# EAGLE board bmsbq (EAGLE 4.13), part 1 of 2
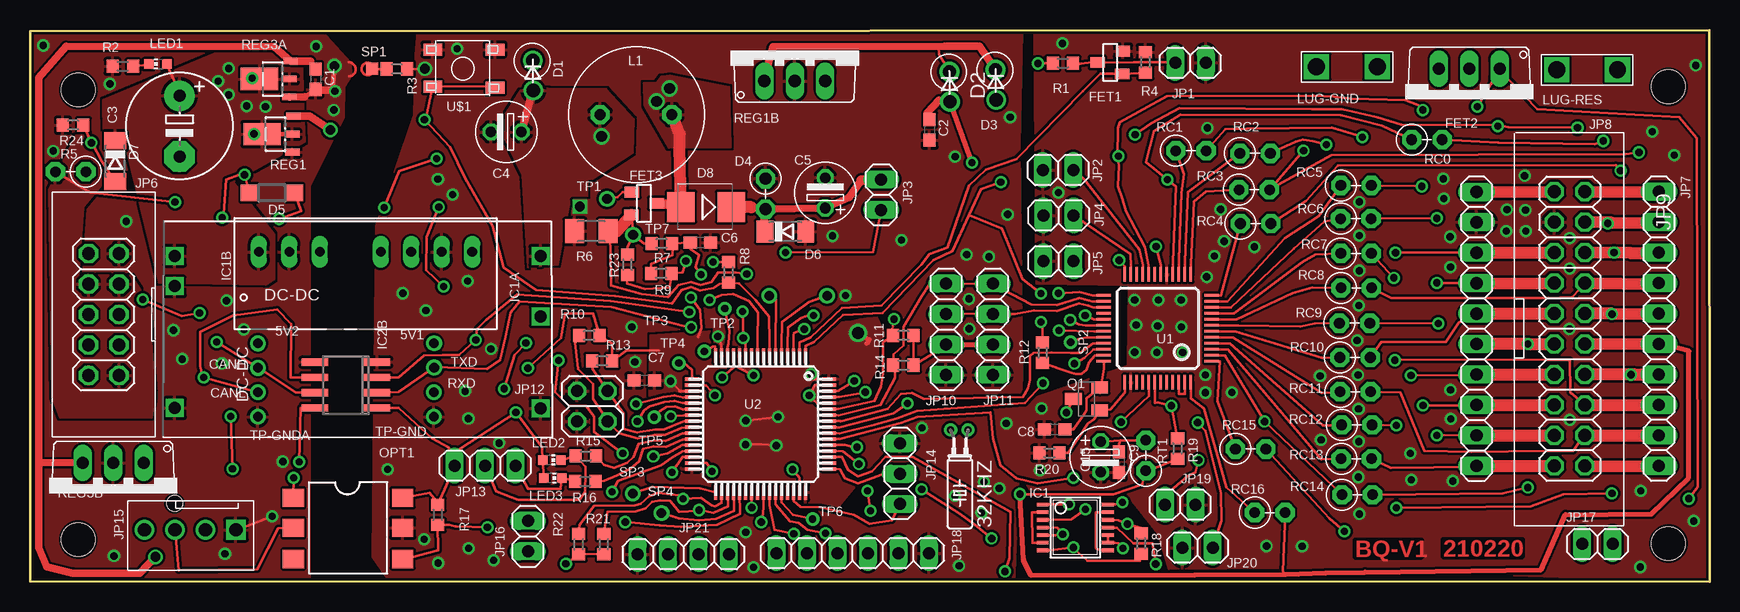
[diagram p2: board, top side]
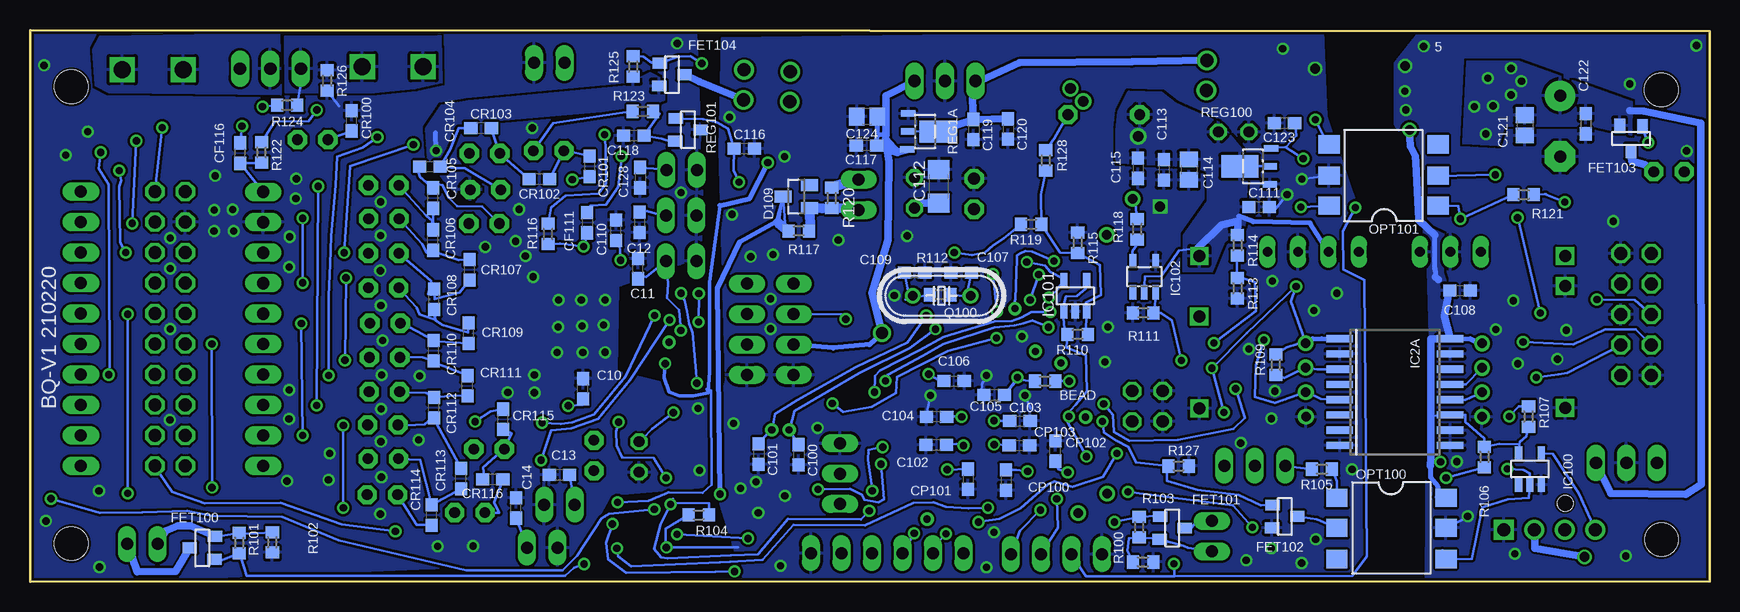
[diagram p3: board, bottom side, seen from below]

Size 140.02 x 46 mm. Coordinates in mm from the lower left corner, seen from the top.
Outline: 0.02,0.01 0,45.89 139.99,46 140.02,0 0.02,0.01
Copper layers (1*16): Top 0.035mm / dielectric 1.5mm / Bottom 0.035mm
Design rules "default": minimum track width 8mil, minimum drill 0.6mm, track to track 8mil, track to pad 8mil, pad to pad 8mil, via to via 8mil, smd to smd 0mil, copper to edge 8mil, drill to drill 8mil, minimum pad ring 10mil, minimum via ring 8mil, stop-mask expansion 4mil, vias tented up to drill 0mil, thermal gap 10mil
Holes 2.8 mm at 136.57,41.26 4.03,41 4.02,3.5 136.57,3.16

## Footprints (pad centres in the part's own frame; a part is rotated, then mirrored left to right if it is on the bottom)
SOLPAD028 = drill 0.8 pad 1.1 round: MP 0,0
32KHZ = drill 0.6 round: 1 -0.67,-3.1; 2 0.77,-3.1
R0603 = smd 1 x 1.1: 1 -0.85,0; 2 0.85,0
C0603 = smd 1.1 x 1: 1 -0.85,0; 2 0.85,0
E5-8,5 = drill 1.016 pad 2.54 round: + -2.54,0 | drill 1.016 pad 2.54 octagon: - 2.54,0
ES-2,5L = drill 0.889 pad 1.27 octagon: 1 0,0; 2 2.54,0
C1206 = smd 1.6 x 1.8: 1 -1.4,0; 2 1.4,0
C0805 = smd 1.3 x 1.5: 1 -0.85,0; 2 0.85,0
DO41-10_VERT = drill 1.1 round: A 2.58,0.05; C 0.07,0
ZENER-VERT = drill 1 pad 1.6 octagon: 1 0,0; 2 2.54,0
SOD123 = smd 1.4 x 1.4: A 1.9,0; C -1.9,0
SOD80C = smd 1.4 x 1.8: A 1.7,0; C -1.7,0
SMB_1 = smd 2.3 x 2.5: A 1.9,0; C -2.3,0
SOT23 = smd 1 x 1.4: 1 -0.95,-1.1; 2 0.95,-1.1; 3 0,1.1
SOT-23 = smd 0.9 x 1.2: 1 -1,-1.006; 2 0.9,-1.056; 3 -0.05,1.056
TO220V = drill 1.016 long: 1 -2.54,-2.54; 2 0,-2.54; 3 2.54,-2.54
TSSOP14 = smd 0.305 x 0.991: 1 -1.905,-2.718; 2 -1.27,-2.718; 3 -0.635,-2.718; 4 0,-2.718; 5 0.635,-2.718; 6 1.27,-2.718; 7 1.905,-2.718; 8 1.905,2.718; 9 1.27,2.718; 10 0.635,2.718; 11 0,2.718; 12 -0.635,2.718; 13 -1.27,2.718; 14 -1.905,2.718
PYBJ6-OD = drill 1 square: 1 -15.25,6.35; 2 -15.25,3.83; 3 -15.25,-6.33; 4 15.24,-6.36; 5 15.25,1.29; 6 15.24,6.35
DCDC7PINB = drill 0.813 long: 1 -7.62,2.51; 2 -5.08,2.51; 3 -2.54,2.51; 5 2.54,2.51; 6 5.08,2.51; 7 7.62,2.51; 8 10.16,2.51
SO-16DW = smd 0.6 x 2.2: 1 -4.445,-4.6; 2 -3.175,-4.6; 3 -1.905,-4.6; 4 -0.635,-4.6; 5 0.635,-4.6; 6 1.905,-4.6; 7 3.175,-4.6; 8 4.445,-4.6; 9 4.445,4.6; 10 3.175,4.6; 11 1.905,4.6; 12 0.635,4.6; 13 -0.635,4.6; 14 -1.905,4.6; 15 -3.175,4.6; 16 -4.445,4.6
SO-08 = smd 0.6 x 2.2: 1 -1.905,-2.6; 2 -0.635,-2.6; 3 0.635,-2.6; 4 1.905,-2.6; 5 1.905,2.6; 6 0.635,2.6; 7 -0.635,2.6; 8 -1.905,2.6
SOT-23' = smd 0.6 x 1.2: 1 -0.95,-1.306; 2 0,-1.306; 3 0.95,-1.306; 4 0.95,1.306; 5 -0.95,1.306
SOT23-5 = smd 0.6 x 1.2: 1 -0.95,-1.306; 2 0,-1.306; 3 0.95,-1.306; 4 0.95,1.306; 5 -0.95,1.306
SOT23-5' = smd 0.55 x 1.2: 1 -0.95,-1.3; 2 0,-1.3; 3 0.95,-1.3; 4 0.95,1.3; 5 -0.95,1.3
1X02 = drill 1 long: 1 -1.27,0; 2 1.27,0
2X05_KEYED = drill 1.067 octagon: 1 -5.08,-1.27; 2 -5.08,1.27; 3 -2.54,-1.27; 4 -2.54,1.27; 5 0,-1.27; 6 0,1.27; 7 2.54,-1.27; 8 2.54,1.27; 9 5.08,-1.27; 10 5.08,1.27
1X10 = drill 1.016 long: 1 -11.43,0; 2 -8.89,0; 3 -6.35,0; 4 -3.81,0; 5 -1.27,0; 6 1.27,0; 7 3.81,0; 8 6.35,0; 9 8.89,0; 10 11.43,0
2X10_KEYED = drill 1.067 octagon: 1 -11.46,-1.27; 2 -11.46,1.27; 3 -8.92,-1.27; 4 -8.92,1.27; 5 -6.38,-1.27; 6 -6.38,1.27; 7 -3.84,-1.27; 8 -3.84,1.27; 9 -1.3,-1.27; 10 -1.3,1.27; 11 1.24,-1.27; 12 1.24,1.27; 13 3.78,-1.27; 14 3.78,1.27; 15 6.32,-1.27; 16 6.32,1.27; 17 8.86,-1.27; 18 8.86,1.27; 19 11.4,-1.27; 20 11.4,1.27
1X04 = drill 1 long: 1 -3.81,0; 2 -1.27,0; 3 1.27,0; 4 3.81,0
2X02 = drill 1.016 octagon: 1 -1.27,-1.27; 2 -1.27,1.27; 3 1.27,-1.27; 4 1.27,1.27
1X03 = drill 1 long: 1 -2.54,0; 2 0,0; 3 2.54,0
1X4-MOLEXKK = drill 1.1 square: 1 3.81,0 | drill 1.1 round: 2 1.27,0; 3 -1.27,0; 4 -3.81,0 | hole 1.3: -1.3,2.2
1X06 = drill 1 long: 1 -6.35,0; 2 -3.81,0; 3 -1.27,0; 4 1.27,0; 5 3.81,0; 6 6.35,0
INDUCTOR6.0 = drill 0.9 pad 1.6 octagon: 1 -3.04,0; 2 2.94,0
CHIP-LED0603 = smd 0.8 x 0.8: A 0,-0.75; C 0,0.75
SPADE_TAB = drill 1.4 square: G1 -2.54,0; G2 2.54,0
SMD-6 = smd 1.52 x 1.78: P$1 -2.5,-4.5; P$2 0,-4.5; P$3 2.6,-4.5; P$4 2.6,4.6; P$5 0,4.6; P$6 -2.5,4.6
SOT23-BEC = smd 1 x 1.4: B -0.95,-1.1; C 0,1.1; E 0.95,-1.1
HC49/S = drill 0.8 round: 1 -2.413,0; 2 2.413,0
RS-2,5 = drill 0.889 pad 1.6 octagon: 1 0,0; 2 2.54,0
M1206 = smd 1.6 x 2: 1 -1.4,0; 2 1.4,0
SOT89 = smd 0.55 x 1.2: 1 -1.5,-1.4; 2 0,-1.4; 3 1.5,-1.5 | smd 1.85 x 3.1: 4 0,1.1
TO220V' = drill 1.016 long: 1 -3.81,-1.27; 2 -1.27,-1.27; 3 1.27,-1.27
SMD03 = smd 1 x 1: 1 0,0
SOLPAD.6MM = drill 0.6 pad 1.1 round: MP 0,0
TQFP48 = smd 0.208 x 1.2: 1 -2.75,-4.5; 2 -2.25,-4.5; 3 -1.75,-4.5; 4 -1.25,-4.5; 5 -0.75,-4.5; 6 -0.25,-4.5; 7 0.25,-4.5; 8 0.75,-4.5; 9 1.25,-4.5; 10 1.75,-4.5; 11 2.25,-4.5; 12 2.75,-4.5; 25 2.75,4.5; 26 2.25,4.5; 27 1.75,4.5; 28 1.25,4.5; 29 0.75,4.5; 30 0.25,4.5; 31 -0.25,4.5; 32 -0.75,4.5; 33 -1.25,4.5; 34 -1.75,4.5; 35 -2.25,4.5; 36 -2.75,4.5 | smd 1.2 x 0.208: 13 4.5,-2.75; 14 4.5,-2.25; 15 4.5,-1.75; 16 4.5,-1.25; 17 4.5,-0.75; 18 4.5,-0.25; 19 4.5,0.25; 20 4.5,0.75; 21 4.5,1.25; 22 4.5,1.75; 23 4.5,2.25; 24 4.5,2.75; 37 -4.5,2.75; 38 -4.5,2.25; 39 -4.5,1.75; 40 -4.5,1.25; 41 -4.5,0.75; 42 -4.5,0.25; 43 -4.5,-0.25; 44 -4.5,-0.75; 45 -4.5,-1.25; 46 -4.5,-1.75; 47 -4.5,-2.25; 48 -4.5,-2.75
TQFP64 = smd 1.2 x 0.26: 1 -5.7,3.75; 2 -5.7,3.25; 3 -5.7,2.75; 4 -5.7,2.25; 5 -5.7,1.75; 6 -5.7,1.25; 7 -5.7,0.75; 8 -5.7,0.25; 9 -5.7,-0.25; 10 -5.7,-0.75; 11 -5.7,-1.25; 12 -5.7,-1.75; 13 -5.7,-2.25; 14 -5.7,-2.75; 15 -5.7,-3.25; 16 -5.7,-3.75; 33 5.7,-3.75; 34 5.7,-3.25; 35 5.7,-2.75; 36 5.7,-2.25; 37 5.7,-1.75; 38 5.7,-1.25; 39 5.7,-0.75; 40 5.7,-0.25; 41 5.7,0.25; 42 5.7,0.75; 43 5.7,1.25; 44 5.7,1.75; 45 5.7,2.25; 46 5.7,2.75; 47 5.7,3.25; 48 5.7,3.75 | smd 0.26 x 1.2: 17 -3.75,-5.7; 18 -3.25,-5.7; 19 -2.75,-5.7; 20 -2.25,-5.7; 21 -1.75,-5.7; 22 -1.25,-5.7; 23 -0.75,-5.7; 24 -0.25,-5.7; 25 0.25,-5.7; 26 0.75,-5.7; 27 1.25,-5.7; 28 1.75,-5.7; 29 2.25,-5.7; 30 2.75,-5.7; 31 3.25,-5.7; 32 3.75,-5.7; 49 3.75,5.7; 50 3.25,5.7; 51 2.75,5.7; 52 2.25,5.7; 53 1.75,5.7; 54 1.25,5.7; 55 0.75,5.7; 56 0.25,5.7; 57 -0.25,5.7; 58 -0.75,5.7; 59 -1.25,5.7; 60 -1.75,5.7; 61 -2.25,5.7; 62 -2.75,5.7; 63 -3.25,5.7; 64 -3.75,5.7
E-SWITCH2 = smd 1.55 x 1: 1 -2.7,1.6; 2 2.5,1.5; 3 2.5,-1.6; 4 -2.7,-1.6

## Placement (x,y rotation side)
5V1  SOLDPAD028  [SOLPAD028]  33.68,19.88 0 top
5V2  SOLDPAD028  [SOLPAD028]  18.99,19.86 0 top
32KHZ  X100  [32KHZ]  77.51,9.55 180 top
BEAD  1  [R0603]  55.41,16.71 180 bottom
C1  1u  [C0603]  23.81,41.89 270 top
C2  1u  [C0603]  74.98,37.67 270 top
C3  0.1u  [E5-8,5]  12.47,37.98 270 top
C4  10@25V  [ES-2,5L]  40.96,37.5 180 top
C5  1u@100v  [ES-2,5L]  66.29,31.14 90 top
C6  0.1u  [C0603]  55.89,28.29 0 top
C7  100n  [C0603]  51.2,16.77 180 top
C8  22n  [C0603]  85.42,12.68 180 top
C9  1u  [C0603]  90.76,9.96 270 top
C10  1u  [C0603]  93.93,16.07 90 bottom
C11  10n  [C0603]  89.33,26.1 90 bottom
C12  10n  [C0603]  89.21,29.96 270 bottom
C13  10n  [C0603]  95.88,8.88 180 bottom
C14  10n  [C0603]  99.5,6.14 90 bottom
C15  1u@100v  [ES-2,5L]  89.25,11.66 270 top
C100  10p  [C0603]  75.94,10.57 270 bottom
C101  10p  [C0603]  79.28,10.63 270 bottom
C102  100n  [C0603]  64.48,11.39 180 bottom
C103  100n  [C0603]  57.5,13.39 0 bottom
C104  1u  [C0603]  64.45,13.74 180 bottom
C105  100n  [C0603]  59.65,15.55 180 bottom
C106  100n  [C0603]  62.99,16.72 0 bottom
C107  15p  [C0603]  62.4,25.77 180 bottom
C108  4.7u  [C0603]  20.82,24.26 0 bottom
C109  15p  [C0603]  66.28,25.79 0 bottom
C110  2.2u  [C0603]  91.15,29.29 90 bottom
C111  4.7u  [C0603]  37.57,31.25 0 bottom
C112  1u@100v  [C1206]  64.26,32.96 90 bottom
C113  10n  [C0603]  45.5,34.33 270 bottom
C114  4.7u  [C0805]  43.42,34.35 270 bottom
C115  0.1u  [C0603]  47.67,34.47 270 bottom
C116  2.2u  [C0603]  80.48,36.12 0 bottom
C117  100n  [C0603]  70.29,36.36 180 bottom
C118  2.2u  [C0603]  89.68,37.17 180 bottom
C119  4.7u  [C0603]  61.36,37.7 270 bottom
C120  100n  [C0603]  58.48,37.74 270 bottom
C121  4.7u  [C0805]  15.42,38.05 270 bottom
C122  4.7u  [C0603]  10.34,38.18 270 bottom
C123  4.7u  [C0603]  35.45,38.21 180 bottom
C124  4.7u  [C0805]  70.24,38.76 180 bottom
C128  10n  [C0603]  89.16,33.69 270 bottom
CANH  SOLDPAD028  [SOLPAD028]  18.99,17.82 0 top
CANL  SOLDPAD028  [SOLPAD028]  18.99,15.78 0 top
CF111  0.1u  [C0603]  93.57,29.93 270 bottom
CF116  0.1u  [C0603]  122.49,35.73 90 bottom
CP100  2.2u  [C0603]  58.67,8.46 270 bottom
CP101  2.2u  [C0603]  61.85,8.53 270 bottom
CP102  4.7u  [C0603]  54.56,10.89 90 bottom
CP103  4.7u  [C0603]  57.54,11.34 0 bottom
CR100  0.1u  [C0603]  113.2,38.43 90 bottom
CR101  0.1u  [C0603]  93.39,34.62 270 bottom
CR102  0.1u  [C0603]  97.57,33.58 0 bottom
CR103  0.1u  [C0603]  102.42,37.83 0 bottom
CR104  0.1u  [C0603]  106.68,34.6 0 bottom
CR105  0.1u  [C0603]  106.42,31.98 90 bottom
CR106  0.1u  [C0603]  106.43,28.48 90 bottom
CR107  0.1u  [C0603]  103.37,26 90 bottom
CR108  0.1u  [C0603]  106.32,23.54 90 bottom
CR109  0.1u  [C0603]  103.44,20.71 90 bottom
CR110  0.1u  [C0603]  106.37,19.25 90 bottom
CR111  0.1u  [C0603]  103.55,16.32 90 bottom
CR112  0.1u  [C0603]  106.35,14.5 90 bottom
CR113  0.1u  [C0603]  104.1,8.59 90 bottom
CR114  0.1u  [C0603]  106.54,5.55 90 bottom
CR115  0.1u  [C0603]  100.57,13.53 90 bottom
CR116  0.1u  [C0603]  101.45,8.51 180 bottom
D1  1N4148  [DO41-10_VERT]  41.91,43.53 270 top
D2  1N4148  [DO41-10_VERT]  76.64,42.59 270 top
D3  1N4148  [DO41-10_VERT]  80.49,42.75 270 top
D4  1N5357  [ZENER-VERT]  61.32,33.59 270 top
D5  1N4448  [SOD123]  20.17,32.42 180 top
D6  MMSZ52  [SOD80C]  62.96,29.19 0 top
D7  MMSZ52  [SOD80C]  7.1,35.06 270 top
D8  B100LB  [SMB_1]  56.16,31.24 180 top
D109  PMEG10020  [SOT23]  76.15,32.1 90 bottom
FET1  NFET  [SOT-23]  90.05,43.34 90 top
FET2  100v NFET  [TO220V]  119.98,40.23 180 top
FET3  PMV280ENEA  [SOT-23]  51.18,31.49 270 top
FET100  si2324A  [SOT-23]  125.65,2.86 90 bottom
FET101  NFET  [SOT-23]  44.81,4.41 270 bottom
FET102  NFET  [SOT-23]  35.43,5.38 270 bottom
FET103  PMV35EPE  [SOT-23]  6.61,36.95 180 bottom
FET104  PFET  [SOT-23]  86.51,42.23 270 bottom
IC1  7400  [TSSOP14]  87.13,4.51 270 top
IC1A  PYBJ6-OD  [PYBJ6-OD]  27.31,20.8 0 top
IC1B  AM6G1215SNZ  [DCDC7PINB]  26.7,24.98 0 top
IC2A  ISO1042-16PIN  [SO-16DW]  26.24,15.8 270 bottom
IC2B  ISO1042 8 PIN  [SO-08]  26.34,16.39 90 top
IC100  74LVC1G14  [SOT-23']  14.99,9.38 0 bottom
IC101  TLV521  [SOT23-5]  52.89,23.83 0 bottom
IC102  MCP1401|1416  [SOT23-5']  47.13,25.43 0 bottom
JP1  PB  [1X02]  96.74,43.26 180 top
JP2  THERM1  [1X02]  85.69,34.33 0 top
JP3  [1X02]  70.95,32.26 90 top
JP4  THERM2  [1X02]  85.73,30.53 0 top
JP5  THERM3  [1X02]  85.73,26.71 0 top
JP6  PINHD-2X5_KEYED  [2X05_KEYED]  6.15,22.27 90 top
JP7  OUTSIDE  [1X10]  135.78,21.08 270 top
JP8  INSIDE  [1X10]  120.58,21.07 270 top
JP9  PINHD-2X10_KEYED  [2X10_KEYED]  128.34,21.05 270 top
JP10  [1X04]  76.37,21.04 90 top
JP11  [1X04]  80.25,21.04 90 top
JP12  [2X02]  46.87,14.62 270 top
JP13  [1X03]  37.93,9.66 0 top
JP14  SWD  [1X03]  72.5,9 270 top
JP15  PINHD-1X4-MOLEXKK  [1X4-MOLEXKK]  13.35,4.32 0 top
JP16  Dump2  [1X02]  41.5,3.79 90 top
JP17  DUMP  [1X02]  130.65,3.13 0 top
JP18  FTDI  [1X06]  68.57,2.37 180 top
JP19  THERM4  [1X02]  95.88,6.41 180 top
JP20  THERM5  [1X02]  97.32,2.83 0 top
JP21  [1X04]  54.46,2.28 0 top
L1  RFB1010  [INDUCTOR6.0]  50.56,38.94 0 top
LED1  [CHIP-LED0603]  10.66,43.16 90 top
LED2  [CHIP-LED0603]  43.49,10.14 270 top
LED3  [CHIP-LED0603]  43.57,8.62 270 top
LUG-GND  MINUS  [SPADE_TAB]  109.78,42.93 0 top
LUG-RES  RESIS  [SPADE_TAB]  129.8,42.68 0 top
OPT1  H11L1S  [SMD-6]  26.46,4.47 270 top
OPT100  H11L1S  [SMD-6]  26.58,4.47 270 bottom
OPT101  H11L1S  [SMD-6]  27.14,33.86 90 bottom
Q1  BCX56-16TF  [SOT23-BEC]  88.07,15.24 90 top
Q100  [HC49/S]  64.03,23.84 180 bottom
R1  100K  [R0603]  86.1,43.22 0 top
R2  6.8K  [R0603]  7.74,42.97 0 top
R3  10M  [R0603]  30.58,42.75 0 top
R4  2M  [R0603]  92.98,43.3 270 top
R5  0.1  [RS-2,5]  4.66,34.18 180 top
R6  0.1  [M1206]  46.79,29.22 0 top
R7  1.5K  [R0603]  52.66,28.2 0 top
R8  10K  [R0603]  58.23,25.78 90 top
R9  zero?  [R0603]  52.61,25.7 0 top
R10  10K  [R0603]  46.61,20.53 0 top
R11  3.3K  [R0603]  72.8,20.53 180 top
R12  zero  [R0603]  84.4,19.08 270 top
R13  10K  [R0603]  47.69,18.4 0 top
R14  3.3K  [R0603]  72.8,18.04 180 top
R15  3.3K  [R0603]  46.33,10.47 0 top
R16  3.3K  [R0603]  46.29,8.35 0 top
R17  10K  [R0603]  33.99,5.56 90 top
R18  470K  [R0603]  92.62,3.18 270 top
R19  10K  [R0603]  95.66,11.1 270 top
R20  10M  [R0603]  84.98,10.72 180 top
R21  3.3K  [R0603]  47.83,3.11 270 top
R22  3.3K  [R0603]  45.73,3.11 270 top
R23  zero?  [R0603]  49.8,26.43 270 top
R24  1M  [R0603]  3.59,38.07 180 top
R100  10K  [R0603]  47.24,1.63 0 bottom
R101  470K  [R0603]  122.58,3.22 270 bottom
R102  1  [R0603]  119.82,3.27 90 bottom
R103  2M  [R0603]  47.56,4.54 270 bottom
R104  470K  [R0603]  84.27,5.56 180 bottom
R105  1.8K  [R0603]  32.33,9.37 180 bottom
R106  1.8K  [R0603]  18.78,10.39 270 bottom
R107  10K  [R0603]  15.11,13.76 270 bottom
R109  100K  [R0603]  36.17,18.07 90 bottom
R110  zero?  [R0603]  52.69,20.61 180 bottom
R111  470K  [R0603]  47.23,22.4 0 bottom
R112  1M  [R0603]  64.13,23.92 0 bottom
R113  6.8K  [R0603]  39.37,24.46 270 bottom
R114  33K  [R0603]  39.37,28.04 270 bottom
R115  210K  [R0603]  52.69,28.26 270 bottom
R116  100  [R0603]  96.84,28.99 270 bottom
R117  zero?  [R0603]  75.94,29.24 0 bottom
R118  6.8  [R0603]  47.73,29.39 270 bottom
R119  4M  [R0603]  56.56,29.79 180 bottom
R120  1  [R0603]  73.19,31.99 270 bottom
R121  3.3K  [R0603]  15.51,32.26 180 bottom
R122  100  [R0603]  120.71,35.79 90 bottom
R123  100K  [R0603]  88.93,39.21 180 bottom
R124  470K  [R0603]  118.58,39.73 180 bottom
R125  1M  [R0603]  89.74,42.95 270 bottom
R126  1K  [R0603]  115.25,41.78 270 bottom
R127  1M  [R0603]  44.27,9.63 0 bottom
R128  64K  [R0603]  55.35,35.13 90 bottom
RC0  [RS-2,5]  115.18,36.85 0 top
RC1  [RS-2,5]  95.51,35.93 0 top
RC2  [RS-2,5]  100.86,35.71 0 top
RC3  [RS-2,5]  100.78,32.68 0 top
RC4  [RS-2,5]  100.9,29.86 0 top
RC5  [RS-2,5]  109.27,33.04 0 top
RC6  [RS-2,5]  109.25,30.26 0 top
RC7  [RS-2,5]  109.27,27.37 0 top
RC8  [RS-2,5]  109.28,24.49 0 top
RC9  [RS-2,5]  109.15,21.55 0 top
RC10  [RS-2,5]  109.19,18.69 0 top
RC11  [RS-2,5]  109.21,15.83 0 top
RC12  [RS-2,5]  109.34,13.06 0 top
RC13  [RS-2,5]  109.3,10.24 0 top
RC14  [RS-2,5]  109.37,7.24 0 top
RC15  [RS-2,5]  100.48,11.05 0 top
RC16  [RS-2,5]  102.09,5.75 0 top
REG1  AP7380Y  [SOT89]  20.46,37.31 90 top
REG1A  AP7380Y  [SOT89]  65.41,37.53 270 bottom
REG1B  VXO7803-500  [TO220V']  65.02,43.02 0 top
REG3A  LDK320ADU120R  [SOT89]  20.23,41.91 90 top
REG3B  LM7812T  [TO220V']  5.67,8.63 180 top
REG100  AP7380Y  [SOT89]  38.07,34.63 90 bottom
REG101  MCP1810  [SOT-23]  85.18,37.62 270 bottom
RT1  680  [RS-2,5]  93.01,9.24 90 top
RXD  SOLDPAD028  [SOLPAD028]  33.67,15.8 0 top
SP1  SMD03  [SMD03]  28.5,42.76 0 top
SP2  SOLDPAD0.6MM  [SOLPAD.6MM]  86.75,19.96 0 top
SP3  SOLDPAD028  [SOLPAD028]  50.24,7.34 0 top
SP4  SOLDPAD028  [SOLPAD028]  52.64,5.72 0 top
TP1  SOLDPAD028  [SOLPAD028]  48.1,31.91 0 top
TP2  SOLDPAD0.6MM  [SOLPAD.6MM]  57.92,22.76 0 top
TP3  SOLDPAD0.6MM  [SOLPAD.6MM]  56.21,19.2 0 top
TP4  SOLDPAD0.6MM  [SOLPAD.6MM]  54.08,18.22 0 top
TP5  SOLDPAD0.6MM  [SOLPAD.6MM]  52.03,13.71 0 top
TP6  SOLDPAD0.6MM  [SOLPAD.6MM]  65.24,5.21 0 top
TP7  SOLDPAD028  [SOLPAD028]  50.27,28.91 0 top
TP-GND  SOLDPAD028  [SOLPAD028]  33.66,13.74 0 top
TP-GNDA  SOLDPAD028  [SOLPAD028]  18.99,13.74 0 top
TXD  SOLDPAD028  [SOLPAD028]  33.69,17.85 0 top
U1  BQ76952  [TQFP48]  94.01,21.11 90 top
U2  STM32F10XRXT6  [TQFP64]  60.9,13.13 270 top
U$1  E-SWITCH2  [E-SWITCH2]  36.07,42.77 180 top